# EasyEDA Pro project gd32e230c8t6v1.eprj

# Schematic GD32E230C8T6
Create Date: 2023-10-20; Page Name: GD32E230C8T6; Project Name: gd32e230c8t6v1; Schematic Name: GD32E230C8T6; Update Date: 2023-11-30; Add into BOM: yes; Company: 嘉立创EDA; Convert to PCB: yes; Page Size: A4; Version: V1.0
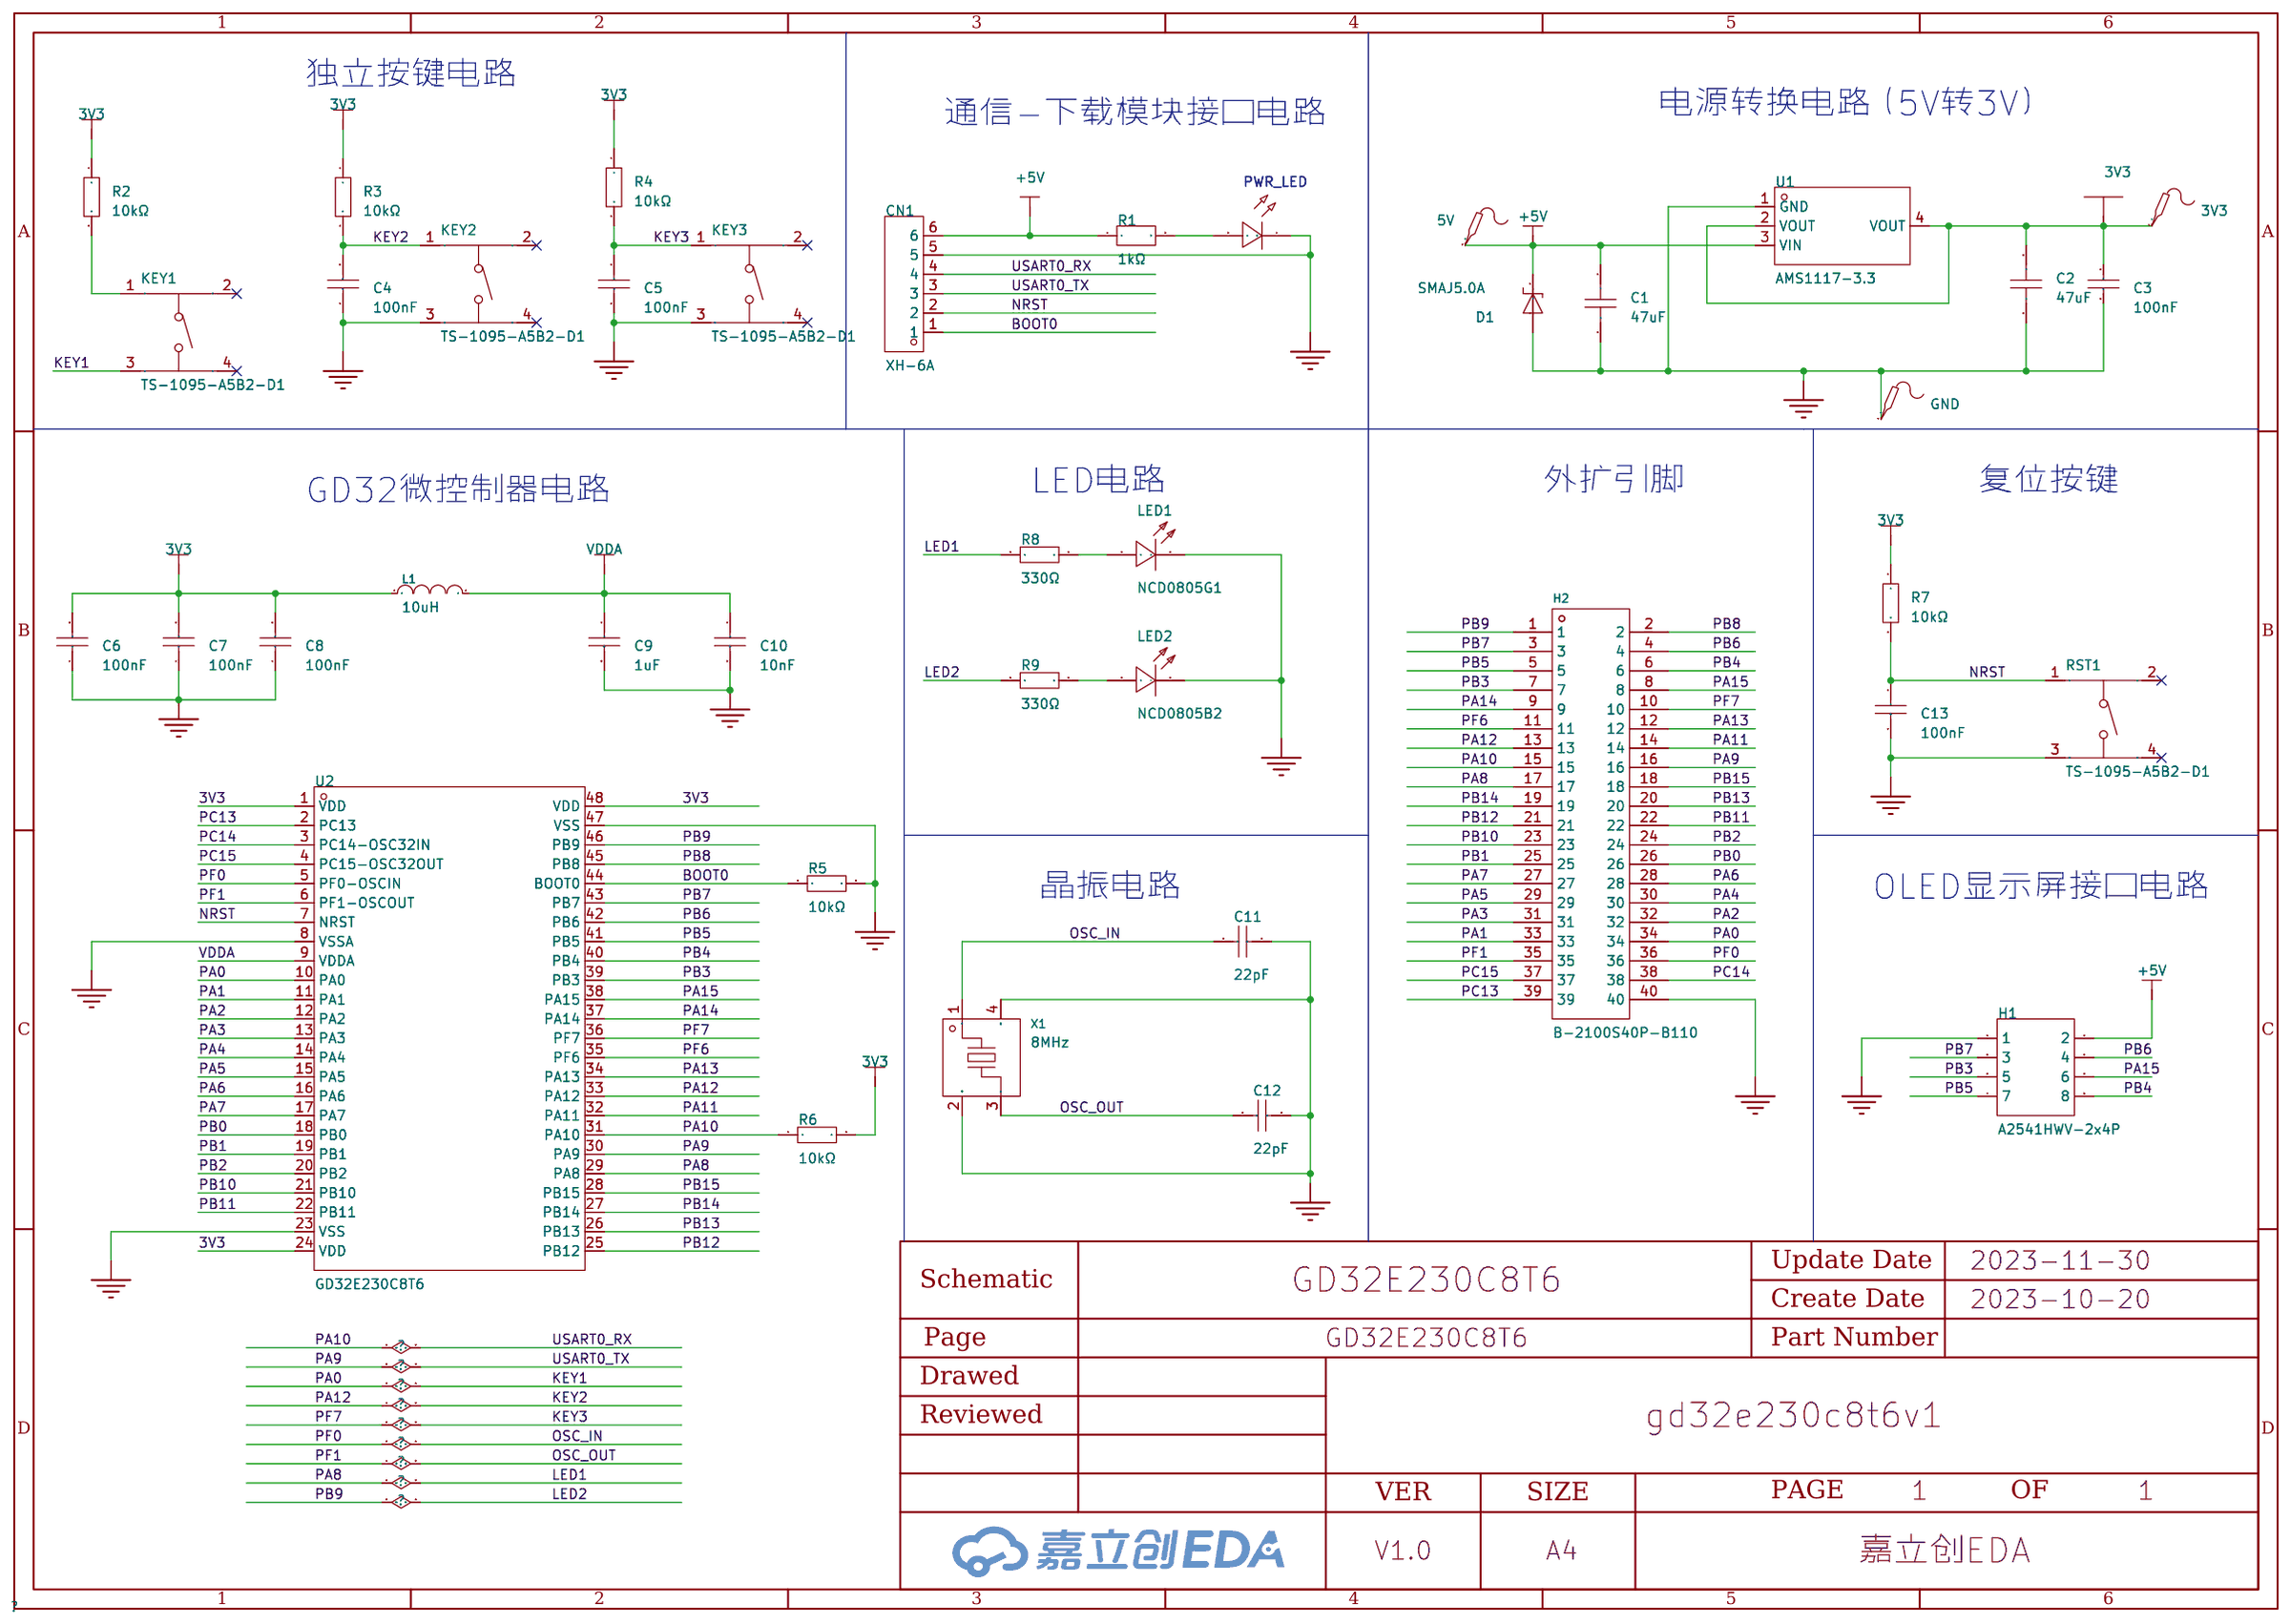
[diagram p0: schematic sheet]

## Parts
3V3  -  [Test-Point-0.5mm]
5V  -  [Test-Point-0.5mm]
C1  47uF  [C1206]
C2  47uF  [C1206]
C3  100nF  [C1206]
C4  100nF  [C0603]
C5  100nF  [C0603]
C6  100nF  [C0603]
C7  100nF  [C0603]
C8  100nF  [C0603]
C9  1uF  [C0603]
C10  10nF  [C0603]
C11  22pF  [C0603]
C12  22pF  [C0603]
C13  100nF  [C0603]
CN1  XH-6A  [CONN-TH_6P-P2.50_HCTL_XH-6A_C2908604]
D1  SMAJ5.0A  [SMA_L4.3-W2.6-LS5.2-FD]
GND  -  [Test-Point-0.5mm]
H1  A2541HWV-2x4P  [HDR-TH_8P-P2.54-V-F-R2-C4-S2.54-1]
H2  B-2100S40P-B110  [HDR-TH_40P-P2.54-V-M-R2-C20-S2.54]
KEY1  TS-1095-A5B2-D1  [SW-TH_4P-L6.0-W6.0-P4.50-LS6.5]
KEY2  TS-1095-A5B2-D1  [SW-TH_4P-L6.0-W6.0-P4.50-LS6.5]
KEY3  TS-1095-A5B2-D1  [SW-TH_4P-L6.0-W6.0-P4.50-LS6.5]
L1  10uH  [L0805]
LED1  NCD0805G1  [LED0805-R-RD]
LED2  NCD0805B2  [LED0805-R-RD]
PWR_LED  -  [LED_0805]
R1  1kΩ  [R0603]
R2  10kΩ  [R0603]
R3  10kΩ  [R0603]
R4  10kΩ  [R0603]
R5  10kΩ  [R0603]
R6  10kΩ  [R0603]
R7  10kΩ  [R0603]
R8  330Ω  [R0603]
R9  330Ω  [R0603]
RST1  TS-1095-A5B2-D1  [SW-TH_4P-L6.0-W6.0-P4.50-LS6.5]
U1  AMS1117-3.3  [SOT-223_L6.5-W3.5-P2.30-LS7.0-BR]
U2  GD32E230C8T6  [LQFP-48_L7.0-W7.0-P0.50-LS9.0-BL]
X1  8MHz  [OSC-SMD_4P-L3.2-W2.5-BL]

## Library data of the parts
3V3 5V GND = Test-Point: Test Point 测试点
C1 C2 = JMK325B7476KMHPR: 容值:47uF;精度:±10%;额定电压:6.3V;材质(温度系数):X7R;; LCSC Part Name: 47uF ±10% 6.3V; Supplier Part: C386026; Manufacturer: TAIYO YUDEN(太诱); Supplier Footprint: 1210; JLCPCB Part Class: Extended Part; Datasheet: https://atta.szlcsc.com/upload/public/pdf/source/20190827/C386026_5009711090E4AA535975339AD2C25863.pdf; Supplier: LCSC; Tolerance: ±10%; Voltage Rated: 6.3V; Temperature Coefficient: X7R
C3 = FN31X104K500PXG: 容值:100nF;精度:±10%;额定电压:50V;温度系数:X7R;; LCSC Part Name: 100nF ±10% 50V; Supplier Part: C464972; Manufacturer: PSA(信昌电陶); Supplier Footprint: 1206; JLCPCB Part Class: Extended Part; Datasheet: https://atta.szlcsc.com/upload/public/pdf/source/20191129/C464972_F56C30176D6B20CF6A8E48930D821D51.pdf; Supplier: LCSC; Tolerance: ±10%; Voltage Rated: 50V; Temperature Coefficient: X7R
C4-C8 C13 = 0603B104K500NT: 容值:100nF;精度:±10%;额定电压:50V;材质(温度系数):X7R;; LCSC Part Name: 100nF ±10% 50V; Supplier Part: C30926; Manufacturer: FH(风华); Supplier Footprint: 0603; JLCPCB Part Class: 扩展库; Datasheet: https://atta.szlcsc.com/upload/public/pdf/source/20170923/C30926_1506149436298988724.pdf; Supplier: LCSC; Tolerance: ±10%; Voltage Rated: 50V; Temperature Coefficient: X7R
C9 = CL10A105KB8NNNC: 容值:1uF;精度:±10%;额定电压:50V;材质(温度系数):X5R;; LCSC Part Name: 1uF ±10% 50V; Supplier Part: C15849; Manufacturer: SAMSUNG(三星); Supplier Footprint: 0603; JLCPCB Part Class: Basic Part; Datasheet: https://atta.szlcsc.com/upload/public/pdf/source/20160103/1457707679084.pdf; Supplier: LCSC; Tolerance: ±10%; Voltage Rated: 50V; Temperature Coefficient: X5R
C10 = CC0603KRX7R9BB103: 容值:10nF;精度:±10%;额定电压:50V;材质(温度系数):X7R;; LCSC Part Name: 10nF ±10% 50V; Supplier Part: C100042; Manufacturer: YAGEO(国巨); Supplier Footprint: 0603; JLCPCB Part Class: Extended Part; Datasheet: https://atta.szlcsc.com/upload/public/pdf/source/20180326/C100042_E8B0111D51DE3671A0A4A59FBCEFE81C.pdf; Supplier: LCSC; Tolerance: ±10%; Voltage Rated: 50V; Temperature Coefficient: X7R
C11 C12 = CL10C220JB8NNNC: 容值:22pF;精度:±5%;额定电压:50V;材质(温度系数):C0G;; LCSC Part Name: 22pF ±5% 50V; Supplier Part: C1653; Manufacturer: SAMSUNG(三星); Supplier Footprint: 0603; JLCPCB Part Class: 基础库; Datasheet: https://atta.szlcsc.com/upload/public/pdf/source/20160218/1457707763339.pdf; Supplier: LCSC; Tolerance: ±5%; Voltage Rated: 50V; Temperature Coefficient: C0G
CN1 = XH-6A: 参考系列:XH;间距:2.5mm;插针结构:1x6P;排数:1;每排PIN数:6;行距:-;公母:公型插针;安装方式:直插;额定电流:3A;工作温度范围:-25℃~+85℃;; LCSC Part Name: XH 2.5mm 1x6P 直插; Supplier Part: C2908604; Manufacturer: HCTL(华灿天禄); Supplier Footprint: 插件,P=2.5mm; JLCPCB Part Class: Extended Part; Datasheet: https://atta.szlcsc.com/upload/public/pdf/source/20211021/653319DEFF6FA72D109D92786067BD8A.pdf; Supplier: LCSC; Reference Series: XH; Pitch: 2.5mm; Pins Structure: 1x6P; Number of Rows: 1; Number of PINs Per Row: 6; Gender: 公型插针; Mounting Style: 直插; Current Rating (Max): 3A; Operating Temperature Range: -25℃~+85℃
D1 = SMAJ5.0A: 极性:单向;反向截止电压(Vrwm):5V;击穿电压(最小值):6.4V;击穿电压(最大值):7V;反向漏电流(Ir):800μA;峰值脉冲电流(Ipp)@10/1000μs:43.5A;最大钳位电压:9.2V;峰值脉冲功率(Ppp)@10/1000μs:400W;; LCSC Part Name: 单向 5V 400W; Supplier Part: C473803; Manufacturer: Slkor(萨科微); Supplier Footprint: SMA; JLCPCB Part Class: Extended Part; Datasheet: https://atta.szlcsc.com/upload/public/pdf/source/20191224/C473803_5CBD384FC89E392B1C1B87C7884E179E.pdf; Supplier: LCSC; Polarity: 单向; Reverse Stand-Off Voltage (Vrwm): 5V; Breakdown Voltage (Min): 6.4V; Breakdown Voltage (Max): 7V; Reverse Leakage Current (Ir): 800μA; Peak Pulse Current (Ipp)@10/1000μs: 43.5A; Maximum Clamping Voltage: 9.2V; Peak Pulse Power Dissipation (Ppp)@10/1000μs: 400W
H1 = A2541HWV-2x4P: 插孔结构:2x4P;间距:2.54mm;总孔位数:8P;安装类型:直插;排数:双排;行距:2.54mm;塑高:-;触头材质:黄铜;触头镀层:金;; LCSC Part Name: 间距:2.54mm 2x4P 直插; Supplier Part: C239344; Manufacturer: CJT(长江连接器); Supplier Footprint: 插件,P=2.54mm; JLCPCB Part Class: 扩展库; Datasheet: https://atta.szlcsc.com/upload/public/pdf/source/20180724/C239359_48B1BC0CA1B4E4396A63955AAFD15564.pdf; Supplier: LCSC; Holes Structure: 2x4P; Pitch: 2.54mm; Number of Holes: 8P; Mounting Type: 直插; Number of Rows: 双排; Row Spacing: 2.54mm; Contact Material: 黄铜; Contact Plating: 金
H2 = B-2100S40P-B110: 排数:双排;总PIN位数:40;间距:2.54mm;插针结构:2x20P;行距:2.54mm;安装类型:直插;圆针/方针:-;额定电流:-;额定电压:-;配合针长度:6mm;塑高:2.54mm;端接针长度:3mm;触头材质:黄铜;触头镀层:-;工作温度范围:-40℃~+105℃;颜色:黑色;; LCSC Part Name: 2.54mm 2x20P 直插; Supplier Part: C124383; Manufacturer: Ckmtw(灿科盟); Supplier Footprint: 直插,P=2.54mm; JLCPCB Part Class: 扩展库; Supplier: LCSC; Number of Rows: 双排; Number of Pins: 40; Pitch: 2.54mm; Pin Structure: 2x20P; Row Spacing: 2.54mm; Mounting Type: 直插; Length of Mating Pin: 6mm; Insulation Height: 2.54mm; Length of End Connection Pin: 3mm; Contact Material: 黄铜; Operating Temperature Range: -40℃~+105℃; Color: 黑色
KEY1-KEY3 RST1 = TS-1095-A5B2-D1: 电路结构:单刀单掷;安装方式:直插;作用力:180gf@±30gf;机械寿命:-;带支架:否;; LCSC Part Name: 6*6*6mm 直插 轻触开关; Supplier Part: C782808; Manufacturer: Yuandi(元迪); Supplier Footprint: 插件; JLCPCB Part Class: 扩展库; Datasheet: https://atta.szlcsc.com/upload/public/pdf/source/20200908/C782804_D14F61DCCBE05C7EE913124CF28857B3.pdf; Supplier: LCSC; Circuit: 单刀单掷; Mounting Style: 直插; Actuator Style: 圆形按钮; Actuator/Cap Color: 黑色; Operating Force: 180gf@±30gf; Pin Style: PC引脚; Switch Length: 6mm; Switch Width: 6mm; Switch Height: 6mm; Strike Gundam: 否
L1 = MCL2012H100MT: 电感值:10uH;精度:±20%;额定电流:100mA;饱和电流(Isat):-;直流电阻(DCR):650mΩ;; LCSC Part Name: 10uH ±20%; Supplier Part: C95978; Manufacturer: Sunlord(顺络); Supplier Footprint: 0805; JLCPCB Part Class: 扩展库; Datasheet: https://atta.szlcsc.com/upload/public/pdf/source/20210916/E7612CB06B128615267F10BD851E53EF.pdf; Supplier: LCSC; Tolerance: ±20%; Rated Current: 100mA; DC Resistance (DCR): 650mΩ; Frequency - Self Resonant: 20MHz
LED1 = NCD0805G1: 发光颜色:翠绿色;功率:72mW;透镜颜色:无色透明;主波长:525nm~537.5nm;发光强度:180mcd~400mcd;发光角度:130°;工作温度:-30℃~+85℃;; LCSC Part Name: 翠绿 0805翠绿  正贴; Supplier Part: C84260; Manufacturer: 国星光电; Supplier Footprint: 0805; JLCPCB Part Class: 扩展库; Datasheet: https://atta.szlcsc.com/upload/public/pdf/source/20200820/C84260_AFC7BF57C6FBA034D182BB8D10A67EFE.pdf; Supplier: LCSC; Emitted Color: 翠绿色; Forward Voltage (VF): 2.5V~3.6V; Forward Current: 5mA; Power Dissipation: 72mW; Lens Color: 无色透明; Dominant Wavelength: 525nm~537.5nm; Luminous Intensity: 180mcd~400mcd; Viewing Angle: 130°; Operating Temperature: -30℃~+85℃
LED2 = NCD0805B2: 发光颜色:蓝色;功率:72mW;透镜颜色:无色透明;主波长:468nm~478nm;发光强度:20mcd~55mcd;发光角度:130°;工作温度:-30℃~+85℃;; LCSC Part Name: 蓝灯 0805蓝灯   正贴; Supplier Part: C84259; Manufacturer: 国星光电; Supplier Footprint: 0805; JLCPCB Part Class: 扩展库; Datasheet: https://atta.szlcsc.com/upload/public/pdf/source/20200820/C84259_E5AC6865415989C4C2C2831134BA3A23.pdf; Supplier: LCSC; Emitted Color: 蓝色; Forward Voltage (VF): 2.5V~3.6V; Forward Current: 2mA; Power Dissipation: 72mW; Lens Color: 无色透明; Dominant Wavelength: 468nm~478nm; Luminous Intensity: 20mcd~55mcd; Viewing Angle: 130°; Operating Temperature: -30℃~+85℃
PWR_LED = LED_0805-B: Supplier Footprint: 0805
R1 = CRCW02011K00JNED: 电阻类型:厚膜电阻;阻值:1kΩ;精度:±5%;功率:50mW;温度系数:±200ppm/℃;; LCSC Part Name: 厚膜电阻 1kΩ ±5% 50mW; Supplier Part: C2073617; Manufacturer: VISHAY(威世); Supplier Footprint: 0201; JLCPCB Part Class: Extended Part; Datasheet: https://atta.szlcsc.com/upload/public/pdf/source/20210426/0D611F86AB3126A358A21AB7F04A2FCC.pdf; Supplier: LCSC; Type: 厚膜电阻; Tolerance: ±5%; Power(Watts): 50mW; Temperature Coefficient: ±200ppm/℃; Overload Voltage (Max): 30V; Operating Temperature Range: -55℃~+155℃
R2-R7 = 0603WAF1002T5E: 电阻类型:厚膜电阻;阻值:10kΩ;精度:±1%;功率:100mW;; LCSC Part Name: 厚膜电阻 10kΩ ±1% 100mW; Supplier Part: C25804; Manufacturer: UNI-ROYAL(厚声); Supplier Footprint: 0603; JLCPCB Part Class: 基础库; Datasheet: https://atta.szlcsc.com/upload/public/pdf/source/20200306/C422600_1E6D84923E4A46A82E41ADD87F860B5C.pdf; Supplier: LCSC; Type: 厚膜电阻; Tolerance: ±1%; Power(Watts): 100mW; Temperature Coefficient: ±100ppm/℃; Overload Voltage (Max): 75V; Operating Temperature Range: -55℃~+155℃
R8 R9 = 0603WAF3300T5E: 阻值:330Ω;精度:±1%;功率:100mW;温度系数:±100ppm/℃;电阻类型:厚膜电阻;; LCSC Part Name: 330Ω ±1% 100mW 厚膜电阻; Supplier Part: C23138; Manufacturer: UNI-ROYAL(厚声); Supplier Footprint: 0603; JLCPCB Part Class: 基础库; Datasheet: https://atta.szlcsc.com/upload/public/pdf/source/20200306/C422600_1E6D84923E4A46A82E41ADD87F860B5C.pdf; Supplier: LCSC; Tolerance: ±1%; Power(Watts): 100mW; Overload Voltage (Max): 75V; Temperature Coefficient: ±100ppm/℃; Type: 厚膜电阻; Operating Temperature Range: -55℃~+155℃
U1 = AMS1117-5.0_C6187: 输出类型:固定;输出极性:正;输出通道数:1;最大输入电压:15V;输出电压:5V;压差:1.3V@(1A);输出电流:1A;电源纹波抑制比(PRSS):68dB@(120Hz);; LCSC Part Name: Vin=15V Vout=5V 1A 68dB@(120Hz); Supplier Part: C6187; Manufacturer: 美国AMS; Supplier Footprint: SOT-223; JLCPCB Part Class: Basic Part; Datasheet: https://atta.szlcsc.com/upload/public/pdf/source/20120416/1457706470701.pdf; Supplier: LCSC; Output Type: 固定; Output Polarity: 正; Number of Outputs: 1; Maximum Input Voltage: 15V; Output Voltage: 5V; Dropout Voltage: 1.3V@(1A); Output Current: 1A; Power Supply Rejection Ratio (PRSS): 68dB@(120Hz)
U2 = GD32E230C8T6: CPU内核:ARM-M系列;CPU最大主频:72MHz;程序存储容量:64KB;程序存储器类型:FLASH;RAM总容量:8KB;GPIO端口数量:39;; LCSC Part Name: ARM-M系列 72MHz; Supplier Part: C380535; Manufacturer: GigaDevice(兆易创新); Supplier Footprint: LQFP-48(7x7); JLCPCB Part Class: 扩展库; Datasheet: https://atta.szlcsc.com/upload/public/pdf/source/20191028/C380535_2A3608A1B122F87D1E8A29B0B3E313D6.pdf; Supplier: LCSC; CPU Core: ARM-M系列; CPU Maximum Speed: 72MHz; Operating Voltage Range: 1.8V~3.6V; Program Storage Size: 64KB; Program Memory Type: FLASH; RAM Size: 8KB; GPIO Ports Number: 39; ADC (Bit): 12bit; PWM (Bit): 16bit; 16Bit Timer: 6; UART/USART: 2; I2C: 2; SPI: 2; Internal Comparator: 有; Peripheral/Function: 片载温度传感器；DMA；看门狗；LIN总线协议；PWM；IrDA；RTC实时时钟; Watchdog: 有; Real-Time Clock: 有; Infrared Data Association: 有; Direct Memory Access: 有; Internal Oscillator: 有; Operating Temperature Range: -40℃~+85℃
X1 = X32258MOB4SI: 频率:8MHz;频率公差:±10ppm;负载电容:12pF;; LCSC Part Name: 8MHz ±10ppm 12pF YSX321SL; Supplier Part: C2682775; Manufacturer: YXC(扬兴晶振); Supplier Footprint: SMD3225-4P; JLCPCB Part Class: 扩展库; Datasheet: https://atta.szlcsc.com/upload/public/pdf/source/20210106/C2682774_0CD4FDA5D9DA3FBEEC23BD607A48E4B0.pdf; Supplier: LCSC; Crystal Type: 贴片无源晶振; Frequency Tolerance: ±10ppm; Frequency Stability: ±30ppm; Load Capacitance: 12pF; Equivalent Series Resistance (ESR): 150Ω; Operating Temperature: -40℃~+85℃

## Nets
3V3: 3V3.1 C2.1 C3.1 C6.2 C7.2 C8.2 L1.1 R2.1 R3.1 R4.1 R6.2 R7.1 U1.2(VOUT) U1.4(VOUT) U2.1(VDD) U2.24(VDD) U2.48(VDD)
+5V: 5V.1 C1.1 CN1.6 D1.2(K) H1.2 R1.1 U1.3(VIN)
GND: C1.2 C2.2 C3.2 C4.1 C5.2 C6.1 C7.1 C8.1 C9.2 C10.2 C11.2 C12.2 C13.2 CN1.5 D1.1(A) GND.1 H1.1 H2.40 KEY2.3 KEY3.3 LED1.2(K) LED2.2(-) PWR_LED.1(C) R5.2 RST1.3 U1.1(GND) U2.8(VSSA) U2.23(VSS) U2.47(VSS) X1.2(GND) X1.4(GND)
VDDA: C9.1 C10.1 L1.2 U2.9(VDDA)
BOOT0: CN1.1 R5.1 U2.44(BOOT0)
KEY1: H2.34 KEY1.3 U2.10(PA0)
KEY2: C4.2 H2.13 KEY2.1 R3.2 U2.33(PA12)
KEY3: C5.1 H2.10 KEY3.1 R4.2 U2.36(PF7)
LED1: H2.17 R8.1 U2.29(PA8)
LED2: H2.1 R9.1 U2.46(PB9)
NRST: C13.1 CN1.2 R7.2 RST1.1 U2.7(NRST)
OSC_IN: C11.1 H2.36 U2.5(PF0-OSCIN) X1.1
OSC_OUT: C12.1 H2.35 U2.6(PF1-OSCOUT) X1.3
PA1: H2.33 U2.11(PA1)
PA2: H2.32 U2.12(PA2)
PA3: H2.31 U2.13(PA3)
PA4: H2.30 U2.14(PA4)
PA5: H2.29 U2.15(PA5)
PA6: H2.28 U2.16(PA6)
PA7: H2.27 U2.17(PA7)
PA9: CN1.3 H2.16 U2.30(PA9)
PA10: CN1.4 H2.15 R6.1 U2.31(PA10)
PA11: H2.14 U2.32(PA11)
PA13: H2.12 U2.34(PA13)
PA14: H2.9 U2.37(PA14)
PA15: H1.6 H2.8 U2.38(PA15)
PB0: H2.26 U2.18(PB0)
PB1: H2.25 U2.19(PB1)
PB2: H2.24 U2.20(PB2)
PB3: H1.5 H2.7 U2.39(PB3)
PB4: H1.8 H2.6 U2.40(PB4)
PB5: H1.7 H2.5 U2.41(PB5)
PB6: H1.4 H2.4 U2.42(PB6)
PB7: H1.3 H2.3 U2.43(PB7)
PB8: H2.2 U2.45(PB8)
PB10: H2.23 U2.21(PB10)
PB11: H2.22 U2.22(PB11)
PB12: H2.21 U2.25(PB12)
PB13: H2.20 U2.26(PB13)
PB14: H2.19 U2.27(PB14)
PB15: H2.18 U2.28(PB15)
PC13: H2.39 U2.2(PC13)
PC14: H2.38 U2.3(PC14-OSC32IN)
PC15: H2.37 U2.4(PC15-OSC32OUT)
PF6: H2.11 U2.35(PF6)
$1N1351: PWR_LED.2(A) R1.2
$1N1886: KEY1.1 R2.2
$1N6758: LED1.1(A) R8.2
$1N6761: LED2.1(+) R9.2

Not connected (* = marked no-connect by the designer): KEY1 2* 4*; KEY2 2* 4*; KEY3 2* 4*; RST1 2* 4*

## Notes on the sheet
- 独立按键电路
- 通信-下载模块接口电路
- 电源转换电路（5V转3V）
- LED电路
- 外扩引脚
- 复位按键
- GD32微控制器电路
- 晶振电路
- OLED显示屏接口电路

# Board GD32E230C8T6
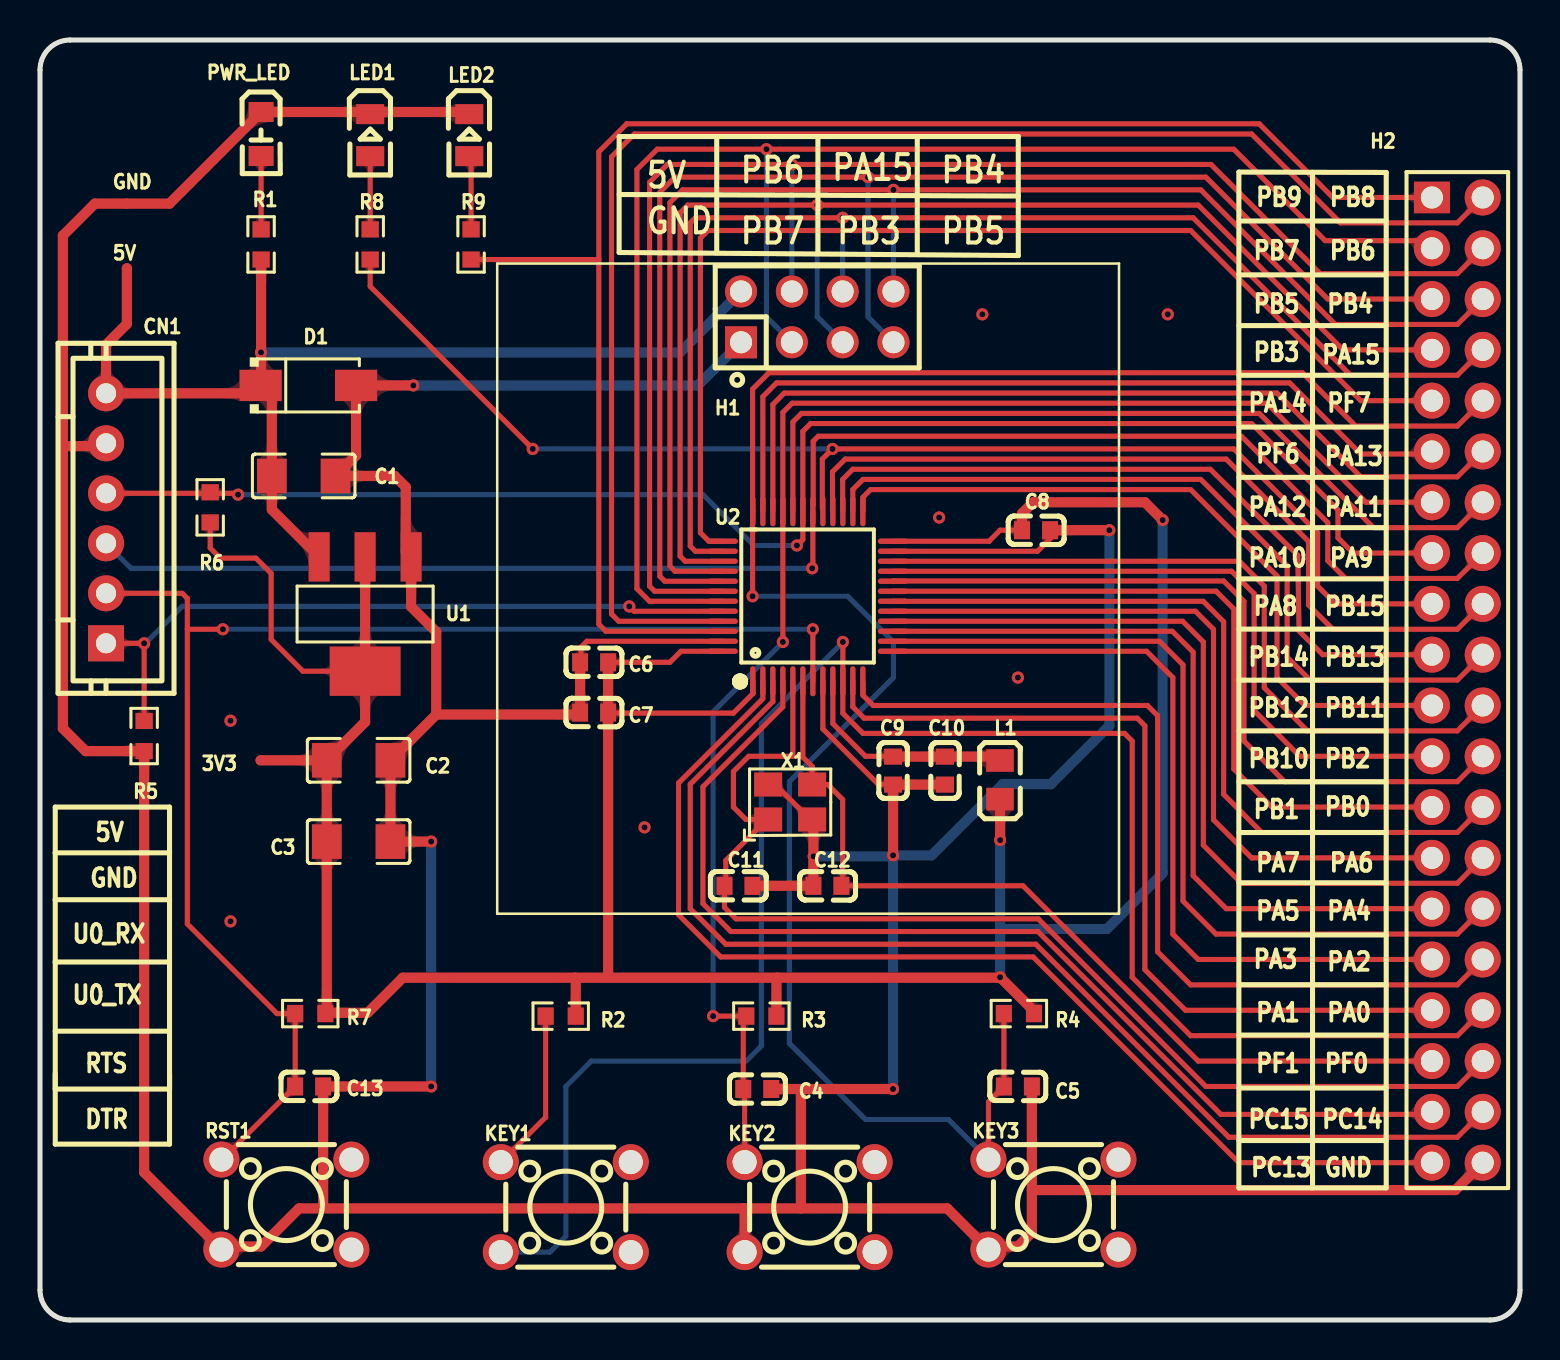
[diagram p1: board, top side]
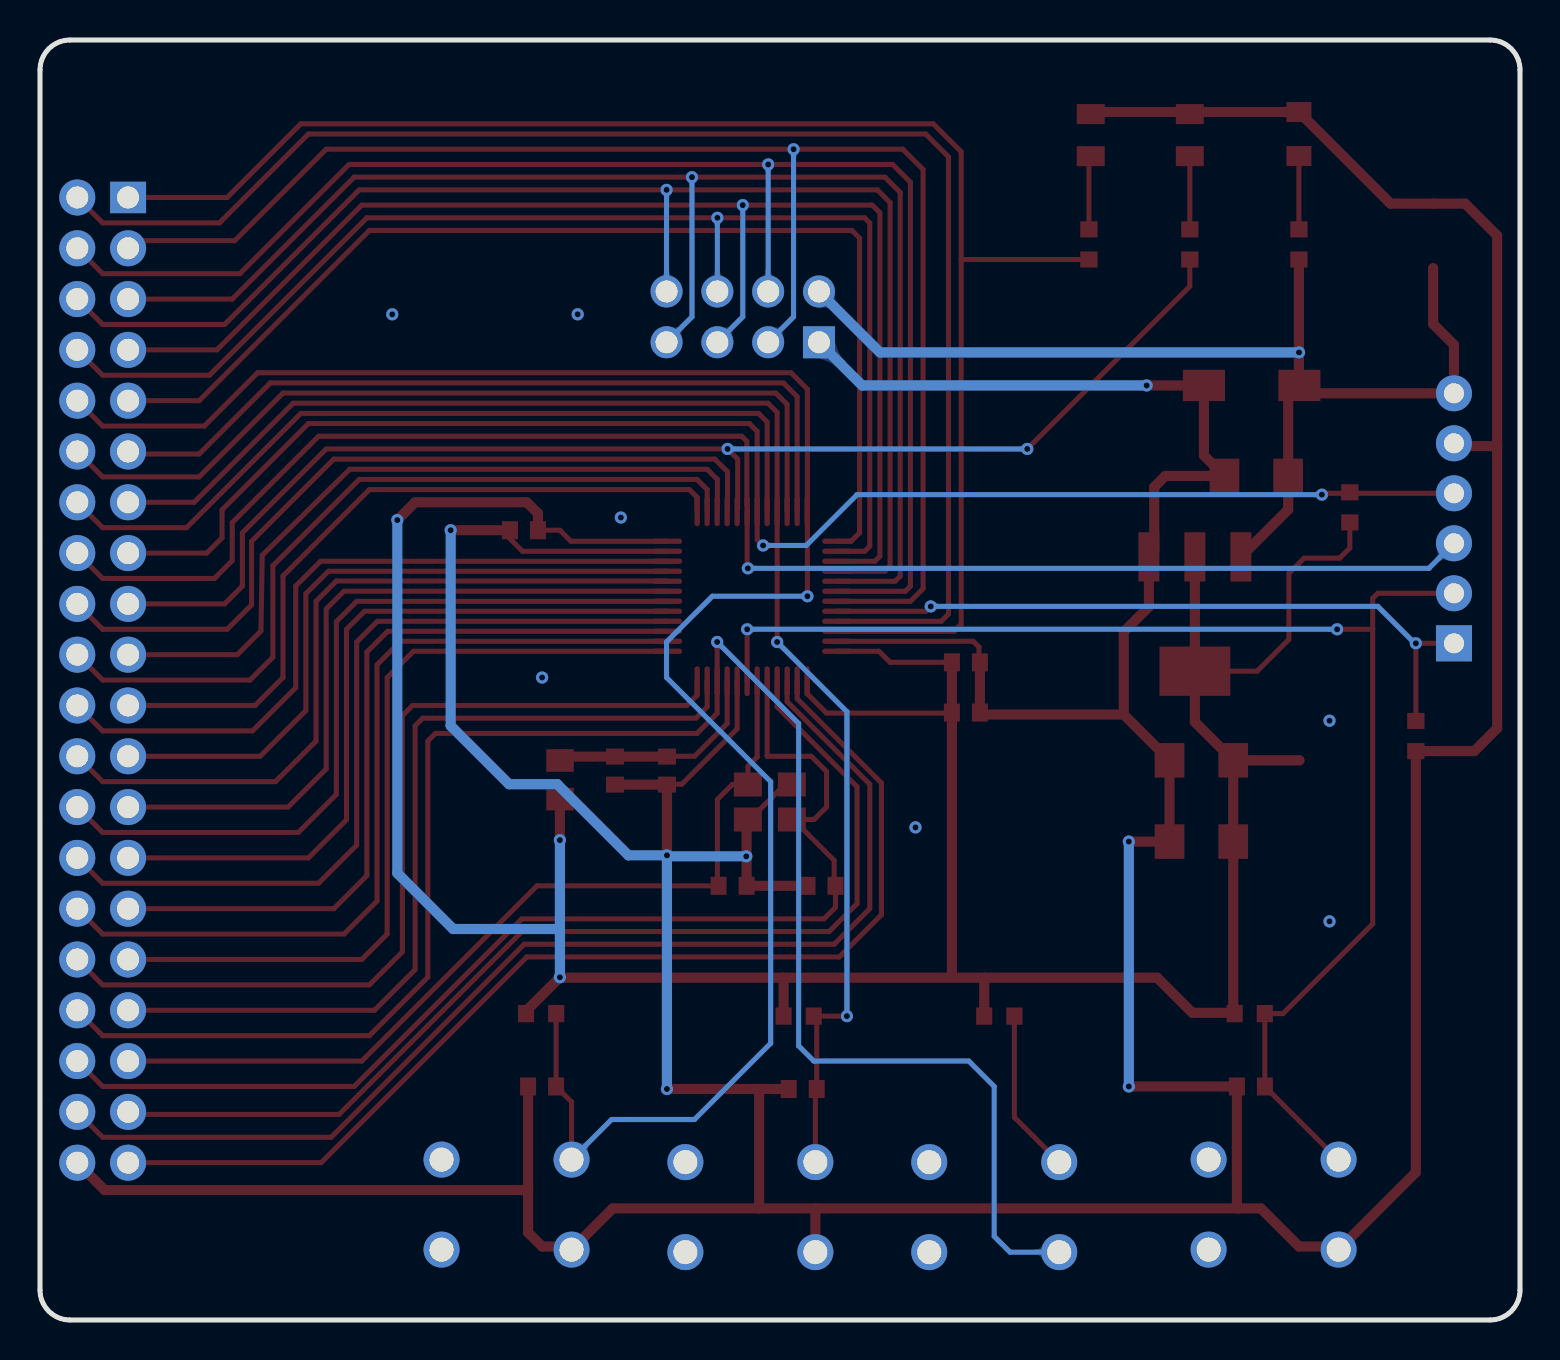
[diagram p2: board, bottom side, seen from below]

Outline 74 x 64 mm; copper layers: Top Layer, Bottom Layer. Coordinates in mm from the lower left corner of the outline.
Outline path: 0,62.5 0,1.5 arc(0.44,0.44) 1.5,0 72.5,0 arc(73.56,0.44) 74,1.5 74,62.5 arc(73.56,63.56) 72.5,64 1.5,64 arc(0.44,63.56) 0,62.5
Stack: Top Layer 0.035mm / Dielectric1 1.51mm FR4 er 4.5 / Bottom Layer 0.035mm

## Design rules (mm)
template: 自定义配置
spacing copperThickness1oz: track to track 0.102, other pairs 0.152 to 0.3
spacing copperThickness2oz: track to track 0.203, other pairs 0.152 to 0.3
spacing safeClearance (default): track to track 0.203, other pairs 0.203 to 0.203
track width copperThickness1oz: min 0.127, default 0.254, max 2.54
track width copperThickness2oz: min 0.203, default 0.254, max 2.54
track width trackWidth (default): min 0.254, default 0.254, max 0.762
track width VCC and GND: min 0.127, default 0.762, max 0.762
differential pair differentialPair (default): width min 0.127, default 0.254, max 2.54; gap min 0.152, default 0.152
via viaSize (default): diameter min 0.5, default 0.61, max 10; hole min 0.3, default 0.305, max 5.999
net GND uses VCC and GND
net +5V uses VCC and GND
net 3V3 uses VCC and GND

## Placement (name value [footprint] x y rotation side)
3V3  -  [Test-Point-0.5mm]  11.03 27.98 0 top
5V  -  [Test-Point-0.5mm]  4.34 52.59 0 top
C1  47uF  [C1206]  13.18 42.2 0 top
C2  47uF  [C1206]  15.93 27.98 0 top
C3  100nF  [C1206]  15.93 23.92 0 top
C4  100nF  [C0603]  35.86 11.55 180 top
C5  100nF  [C0603]  48.9 11.68 0 top
C6  100nF  [C0603]  27.71 32.89 0 top
C7  100nF  [C0603]  27.71 30.37 0 top
C8  100nF  [C0603]  49.8 39.49 180 top
C9  1uF  [C0603]  42.65 27.47 270 top
C10  10nF  [C0603]  45.25 27.47 270 top
C11  22pF  [C0603]  34.93 21.71 0 top
C12  22pF  [C0603]  39.37 21.71 180 top
C13  100nF  [C0603]  13.46 11.68 0 top
CN1  XH-6A  [CONN-TH_6P-P2.50_HCTL_XH-6A_C2908604]  3.3 40.08 90 top
D1  SMAJ5.0A  [SMA_L4.3-W2.6-LS5.2-FD]  13.42 46.73 180 top
GND  -  [Test-Point-0.5mm]  4.34 55.82 0 top
H1  A2541HWV-2x4P  [HDR-TH_8P-P2.54-V-F-R2-C4-S2.54-1]  38.86 50.16 0 top
H2  B-2100S40P-B110  [HDR-TH_40P-P2.54-V-M-R2-C20-S2.54]  70.87 32 270 top
KEY1  TS-1095-A5B2-D1  [SW-TH_4P-L6.0-W6.0-P4.50-LS6.5]  26.29 5.64 0 top
KEY2  TS-1095-A5B2-D1  [SW-TH_4P-L6.0-W6.0-P4.50-LS6.5]  38.48 5.64 0 top
KEY3  TS-1095-A5B2-D1  [SW-TH_4P-L6.0-W6.0-P4.50-LS6.5]  50.67 5.77 0 top
L1  10uH  [L0805]  48 27.01 90 top
LED1  NCD0805G1  [LED0805-R-RD]  16.51 59.24 270 top
LED2  NCD0805B2  [LED0805-R-RD]  21.46 59.24 270 top
PWR_LED  -  [LED_0805]  11.05 59.25 270 top
R1  1kΩ  [R0603]  11.05 53.78 90 top
R2  10kΩ  [R0603]  26.03 15.19 180 top
R3  10kΩ  [R0603]  36.07 15.19 180 top
R4  10kΩ  [R0603]  48.94 15.32 180 top
R5  10kΩ  [R0603]  5.21 29.2 270 top
R6  10kΩ  [R0603]  8.51 40.63 270 top
R7  10kΩ  [R0603]  13.51 15.32 180 top
R8  330Ω  [R0603]  16.51 53.78 90 top
R9  330Ω  [R0603]  21.55 53.78 90 top
RST1  TS-1095-A5B2-D1  [SW-TH_4P-L6.0-W6.0-P4.50-LS6.5]  12.32 5.77 0 top
U1  AMS1117-3.3  [SOT-223_L6.5-W3.5-P2.30-LS7.0-BR]  16.26 35.3 90 top
U2  GD32E230C8T6  [LQFP-48_L7.0-W7.0-P0.50-LS9.0-BL]  38.39 36.19 0 top
X1  8MHz  [OSC-SMD_4P-L3.2-W2.5-BL]  37.51 25.9 0 top

## Footprints (pads in the part's own frame, mm; a bottom-side part is the same pattern mirrored in y, then rotated)
C0603
  rect 0.8x0.9 smd: 1(-0.7,0) 2(0.7,0)
C1206
  rect 1.485x1.728 smd: 1(-1.593,0) 2(1.593,0)
CONN-TH_6P-P2.50_HCTL_XH-6A_C2908604
  rect 1.8x1.8 hole 1: 1(-6.25,0.001)
  round 1.8 hole 1: 2(-3.749,0.001) 3(-1.25,0.001) 4(1.25,0) 5(3.75,-0.001) 6(6.25,-0.001)
HDR-TH_8P-P2.54-V-F-R2-C4-S2.54-1
  rect 1.6x1.6 hole 1.1: 1(-3.81,-1.27)
  round 1.6 hole 1.1: 2(-3.81,1.27) 3(-1.27,-1.27) 4(-1.27,1.27) 5(1.27,-1.27) 6(1.27,1.27) 7(3.81,-1.27) 8(3.81,1.27)
HDR-TH_40P-P2.54-V-M-R2-C20-S2.54
  rect 1.575x1.8 hole 1.1: 1(-24.13,-1.27)
  round 1.8 hole 1.1: 2(-24.13,1.27) 3(-21.59,-1.27) 4(-21.59,1.27) 5(-19.05,-1.27) 6(-19.05,1.27) 7(-16.51,-1.27) 8(-16.51,1.27) 9(-13.97,-1.27) 10(-13.97,1.27) 11(-11.43,-1.27) 12(-11.43,1.27) 13(-8.89,-1.27) 14(-8.89,1.27) 15(-6.35,-1.27) 16(-6.35,1.27) 17(-3.81,-1.27) 18(-3.81,1.27) 19(-1.27,-1.27) 20(-1.27,1.27) 21(1.27,-1.27) 22(1.27,1.27) 23(3.81,-1.27) 24(3.81,1.27) 25(6.35,-1.27) 26(6.35,1.27) 27(8.89,-1.27) 28(8.89,1.27) 29(11.43,-1.27) 30(11.43,1.27) 31(13.97,-1.27) 32(13.97,1.27) 33(16.51,-1.27) 34(16.51,1.27) 35(19.05,-1.27) 36(19.05,1.27) 37(21.59,-1.27) 38(21.59,1.27) 39(24.13,-1.27) 40(24.13,1.27)
L0805
  rect 1.133x1.377 smd: 1(-0.966,0) 2(0.966,0)
LED0805-R-RD
  rect 1x1.399 smd: 1(1.05,0) 2(-1.05,0)
LED_0805
  rect 1x1.25 smd: 1(-1.15,0.005) 2(1.05,0.005)
LQFP-48_L7.0-W7.0-P0.50-LS9.0-BL
  oval 0.27x1.5 smd: 1(-2.75,-4.25) 2(-2.25,-4.25) 3(-1.75,-4.25) 4(-1.25,-4.25) 5(-0.75,-4.25) 6(-0.25,-4.25) 7(0.25,-4.25) 8(0.75,-4.25) 9(1.25,-4.25) 10(1.75,-4.25) 11(2.25,-4.25) 12(2.75,-4.25) 25(2.75,4.25) 26(2.25,4.25) 27(1.75,4.25) 28(1.25,4.25) 29(0.75,4.25) 30(0.25,4.25) 31(-0.25,4.25) 32(-0.75,4.25) 33(-1.25,4.25) 34(-1.75,4.25) 35(-2.25,4.25) 36(-2.75,4.25)
  oval 1.5x0.27 smd: 13(4.25,-2.75) 14(4.25,-2.25) 15(4.25,-1.75) 16(4.25,-1.25) 17(4.25,-0.75) 18(4.25,-0.25) 19(4.25,0.25) 20(4.25,0.75) 21(4.25,1.25) 22(4.25,1.75) 23(4.25,2.25) 24(4.25,2.75) 37(-4.25,2.75) 38(-4.25,2.25) 39(-4.25,1.75) 40(-4.25,1.25) 41(-4.25,0.75) 42(-4.25,0.25) 43(-4.25,-0.25) 44(-4.25,-0.75) 45(-4.25,-1.25) 46(-4.25,-1.75) 47(-4.25,-2.25) 48(-4.25,-2.75)
OSC-SMD_4P-L3.2-W2.5-BL
  rect 1.4x1.2 smd: 1(-1.1,-0.875) 2(1.1,-0.875) 3(1.1,0.875) 4(-1.1,0.875)
R0603
  rect 0.806x0.864 smd: 1(-0.753,0) 2(0.753,0)
SMA_L4.3-W2.6-LS5.2-FD
  rect 2.107x1.566 smd: 1(-2.386,0) 2(2.386,0)
SOT-223_L6.5-W3.5-P2.30-LS7.0-BR
  rect 2.465x1.05 smd: 1(2.857,-2.3) 2(2.857,0) 3(2.857,2.3)
  rect 2.465x3.54 smd: 4(-2.857,0)
SW-TH_4P-L6.0-W6.0-P4.50-LS6.5
  round 1.8 hole 1.2: 1(-3.25,2.25) 2(3.25,2.25) 3(-3.25,-2.25) 4(3.25,-2.25)
Test-Point-0.5mm
  round 0.5 smd: 1(0,0)

## Nets
As in the schematic.

Pads without a net: KEY1 2 4; KEY2 2 4; KEY3 2 4; RST1 2 4

## Via types
v1: diameter 0.61, hole 0.305, Top Layer to Bottom Layer, 37 vias

## Routing (per net, layer and track width the routed paths; a pad name or vN(x,y) marks a point on that pad's centre or on a via; arc(x,y) is an arc through that point)
3V3: length 162.3
  Top Layer w0.254: U2.24 47.45,38.94 48.01,39.49 C8.2 ; R6.2 8.51,38.6 9.02,38.09 10.8,38.09 11.56,37.33 11.56,34.03 13.14,32.44 U1.4 ; C6.2 31.5,32.89 32.05,33.44 U2.48 ; U2.1 35.64,31.32 34.67,30.34 28.43,30.34 C7.2
  Top Layer w0.508: 14.34,15.39 14.37,15.36 16.38,15.36 18.14,17.12 26.76,17.12 ; 14.34,15.39 R7.1 ; 14.34,15.39 C3.1 C2.1 ; R3.1 36.82,17.09 36.85,17.12 ; U1.2 U1.4 16.26,29.9 C2.1 ; 26.76,17.12 36.85,17.12 ; 26.76,17.12 26.79,17.09 R2.1 ; 36.85,17.12 47.98,17.12 v1(48.01,17.14) 49.66,15.49 49.66,15.32 R4.1 ; C2.1 3V3.1 ; 28.41,17.16 C7.2 C6.2 ; v1(56.13,40) 55.25,40.89 49.66,40.89 49.1,40.33 C8.2 ; v1(48.01,24) 48.01,26.04 L1.1
  Bottom Layer w0.508: 48.01,19.55 53.34,19.55 56.13,22.34 v1(56.13,40) ; 48.01,19.55 v1(48.01,24) ; 48.01,19.55 v1(48.01,17.14)
+5V: length 56
  Top Layer w0.508: CN1.6 3.43,46.33 ; 3.43,46.33 10.64,46.33 11.03,46.73 ; 3.43,46.33 3.3,46.46 3.3,48.76 4.34,49.8 5V.1 ; R1.1 11.05,46.75 11.03,46.73 ; 11.03,46.73 11.59,46.17 C1.1 11.59,40.52 U1.3
  Bottom Layer w0.508: 35.05,51.43 32,48.38 v1(11.05,48.38)
GND: length 332.6
  Top Layer w0.254: 16.4,60.4 LED1.2 ; U2.47 27.34,33.94 27.05,33.65 27.05,32.93 27,32.89 ; U2.23 49.88,38.44 50.67,39.23 ; X1.4 36.76,26.78 38.51,25.03 38.61,25.03 ; C9.2 42.63,26.79 41.91,26.79 39.14,29.56 U2.8
  Top Layer w0.508: 35.19,5.58 14.1,5.58 ; 35.19,5.58 35.23,5.54 KEY2.3 ; 35.19,5.58 38.04,5.58 ; 14.1,5.58 12.95,5.58 11.05,3.68 9.22,3.68 RST1.3 5.21,7.38 R5.2 2.28,28.44 1.14,29.58 1.14,43.69 ; 14.1,5.58 14.16,5.64 C13.2 v1(19.56,11.68) ; 38.04,11.55 v1(42.65,11.55) ; 38.04,11.55 C4.1 ; 38.04,11.55 38.04,5.58 ; 1.14,43.69 3.16,43.69 CN1.5 ; 1.14,43.69 1.14,54.22 2.74,55.82 GND.1 6.47,55.82 PWR_LED.1 21.36,60.4 LED2.2 ; v1(42.65,23.23) C9.2 C10.2 ; C8.1 v1(53.47,39.49) ; 19.81,30.27 19.81,34.41 18.56,35.67 U1.1 18.29,38.42 18.29,41.65 17.73,42.2 14.78,42.2 15.8,43.23 D1.1 v1(18.67,46.73) ; 19.81,30.27 C2.2 C3.2 v1(19.56,23.92) ; 19.81,30.27 26.91,30.27 27,30.37 27,32.89 ; 49.59,6.5 49.59,4.38 48.9,3.68 47.58,3.68 KEY3.3 45.36,5.58 38.04,5.58 ; 49.59,6.5 70.77,6.5 H2.40 ; 49.59,6.5 C5.2 ; C11.2 C12.2 38.67,24.96 38.61,25.03
  Bottom Layer w0.508: v1(42.65,11.55) v1(42.65,23.23) 44.58,23.23 48.13,26.79 50.55,26.79 53.47,29.71 v1(53.47,39.49) ; v1(38.69,23.18) 42.54,23.18 ; v1(18.67,46.73) 32.89,46.73 H1.1 ; v1(19.56,23.92) v1(19.56,11.68)
  vias: v1(9.53,29.96) v1(9.53,19.93) v1(30.23,24.63) v1(44.96,40.12) v1(47.12,50.28) v1(48.9,32.12) v1(56.39,50.28)
VDDA: length 11.2
  Top Layer w0.254: C9.1 42.64,28.19 41.28,28.19 39.64,29.82 U2.9
  Top Layer w0.508: L1.2 47.81,28.17 C10.1 C9.1
BOOT0: length 35.6
  Top Layer w0.254: R5.1 v1(5.21,33.83) CN1.1 ; U2.44 29.71,35.44 v1(29.46,35.68)
  Bottom Layer w0.254: v1(29.46,35.68) 29.47,35.68 29.47,35.68 7.11,35.68 5.2,33.77
KEY1: length 93.3
  Top Layer w0.254: v1(40.14,33.9) U2.10 40.14,30.33 41.15,29.33 54.23,29.33 54.61,28.95 54.61,17.14 57.53,14.22 70.87,14.22 H2.34
  Bottom Layer w0.254: v1(40.14,33.9) 36.07,29.83 36.07,13.71 35.31,12.95 27.56,12.95 26.29,11.68 26.29,4.18 25.5,3.39 KEY1.3
KEY2: length 75.4
  Top Layer w0.254: KEY2.1 35.23,11.48 C4.2 35.16,15.07 35.04,15.19 ; 35.04,15.19 v1(33.66,15.19) ; 35.04,15.19 R3.2 ; H2.13 66.29,40.89 61.34,45.84 37.6,45.84 37.14,45.38 U2.33 v1(37.14,33.9)
  Bottom Layer w0.254: v1(37.14,33.9) 33.66,30.41 v1(33.66,15.19)
KEY3: length 99.1
  Top Layer w0.254: U2.36 35.63,40.45 ; 35.63,40.45 v1(35.63,36.19) ; 35.63,40.45 35.63,46.54 36.45,47.36 63.12,47.36 65.79,44.7 70.87,44.7 H2.10 ; KEY3.1 47.42,10.9 C5.1 48.19,15.32 R4.2
  Bottom Layer w0.254: v1(35.63,36.19) 40.39,36.19 42.67,33.9 42.67,32.12 37.47,26.92 37.47,13.83 41.28,10.03 45.42,10.03 KEY3.1
LED1: length 65.5
  Top Layer w0.254: H2.17 64.77,35.81 63.88,36.69 63.88,39.36 59.69,43.55 v1(39.62,43.55) 39.12,43.05 39.12,40.57 ; R8.1 16.51,51.68 v1(24.64,43.55)
  Bottom Layer w0.254: v1(24.64,43.55) 39.37,43.55
LED2: length 80.1
  Top Layer w0.254: R9.1 27.92,53.02 27.94,53.05 ; 27.94,53.05 27.94,58.41 29.34,59.81 60.96,59.81 64.64,56.13 H2.1 ; 27.94,53.05 27.94,34.79 28.29,34.44 U2.46
NRST: length 70.4
  Top Layer w0.254: 7.37,34.56 7.37,36.08 7.11,36.33 CN1.2 ; 7.37,34.56 7.37,19.8 11.85,15.32 R7.2 12.76,11.68 C13.1 9.1,8.02 RST1.1 ; 7.37,34.56 7.39,34.54 v1(9.14,34.54) ; U2.7 v1(38.64,34.54)
  Bottom Layer w0.254: 38.61,34.54 v1(9.14,34.54)
OSC_IN: length 58.2
  Top Layer w0.254: 36.34,25.03 35.29,25.03 34.67,25.65 34.67,27.42 35.43,28.19 37.64,28.19 U2.5 ; 36.34,25.03 X1.1 ; 36.34,25.03 34.29,22.98 34.29,21.77 34.22,21.71 34.22,20.63 34.8,20.06 49.91,20.06 58.29,11.68 70.87,11.68 H2.36
OSC_OUT: length 44.7
  Top Layer w0.254: H2.35 57.91,12.95 49.15,21.71 C12.1 40.13,21.77 40.13,26.03 39.38,26.78 38.61,26.78 38.61,27.68 38.14,28.14 U2.6
PA1: length 43.7
  Top Layer w0.254: H2.33 57.28,15.49 55.25,17.52 55.25,29.71 54.86,30.09 41.21,30.09 40.64,30.66 40.64,31.93 U2.11
PA2: length 45.1
  Top Layer w0.254: 41.15,31.87 41.15,31.23 41.66,30.73 55.37,30.73 55.88,30.22 55.88,18.41 57.53,16.76 70.87,16.76 H2.32
PA3: length 40.9
  Top Layer w0.254: U2.13 55.33,33.44 56.64,32.12 56.64,19.3 57.91,18.03 H2.31
PA4: length 43
  Top Layer w0.254: U2.14 55.97,33.94 57.15,32.76 57.15,20.95 58.8,19.3 70.87,19.3 H2.30
PA5: length 39.2
  Top Layer w0.254: H2.29 59.31,20.57 57.66,22.22 57.66,33.39 56.61,34.44 U2.15
PA6: length 41.4
  Top Layer w0.254: H2.28 70.87,21.84 60.07,21.84 58.17,23.74 58.17,33.9 57.13,34.94 U2.16
PA7: length 37.6
  Top Layer w0.254: H2.27 60.58,23.11 58.67,25.01 58.67,34.54 57.77,35.44 U2.17
PA9: length 80.1
  Top Layer w0.254: 38.66,40.74 38.66,43.93 38.91,44.19 60.07,44.19 64.39,39.87 64.39,37.97 65.28,37.08 70.87,37.08 H2.16 ; v1(38.61,37.58) 38.64,37.62 U2.30
  Bottom Layer w0.254: v1(38.61,37.58) 4.55,37.58 CN1.3
PA10: length 76.6
  Top Layer w0.254: 8.46,41.33 9.84,41.33 v1(9.91,41.27) ; 8.46,41.33 R6.1 ; 8.46,41.33 CN1.4 ; v1(37.85,38.73) 38.14,39.02 U2.31 38.14,44.43 38.53,44.82 60.58,44.82 64.9,40.5 64.9,39.11 65.66,38.35 H2.15
  Bottom Layer w0.254: v1(9.91,41.27) 33.15,41.27 35.69,38.73 v1(37.85,38.73)
PA11: length 42
  Top Layer w0.254: U2.32 37.64,44.9 38.07,45.33 60.96,45.33 66.68,39.62 70.87,39.62 H2.14
PA13: length 43.3
  Top Layer w0.254: H2.12 70.87,42.16 66.04,42.16 61.85,46.35 37.21,46.35 36.64,45.78 U2.34
PA14: length 56.3
  Top Layer w0.254: H2.9 66.04,45.97 57.53,54.47 33.4,54.47 33.02,54.09 33.02,39.36 33.44,38.94 U2.37
PA15: length 65.1
  Top Layer w0.254: H2.8 70.87,47.24 65.53,47.24 57.66,55.11 v1(40.13,55.11) 32.77,55.11 32.51,54.86 32.51,38.69 32.77,38.44 U2.38
  Bottom Layer w0.254: v1(40.13,55.11) 40.13,51.43
PB0: length 39.9
  Top Layer w0.254: U2.18 42.65,35.93 58.17,35.93 59.18,34.92 59.18,26.28 61.09,24.38 70.87,24.38 H2.26
PB1: length 36.1
  Top Layer w0.254: H2.25 61.59,25.65 59.69,27.55 59.69,35.55 58.8,36.44 42.65,36.44 U2.19
PB2: length 38.3
  Top Layer w0.254: U2.20 42.65,36.95 59.18,36.95 60.2,35.93 60.2,28.95 62.23,26.92 70.87,26.92 H2.24
PB3: length 66.7
  Top Layer w0.254: 33.4,37.94 32.26,37.94 32,38.19 32,55.36 32.38,55.75 v1(38.86,55.75) 57.91,55.75 65.15,48.51 H2.7
  Bottom Layer w0.254: H1.5 38.86,50.16 38.86,55.62
PB4: length 70.2
  Top Layer w0.254: H2.6 70.87,49.78 64.77,49.78 58.04,56.51 v1(42.67,56.51) 32.13,56.51 31.5,55.87 31.5,37.69 31.75,37.44 U2.40
  Bottom Layer w0.254: v1(42.67,56.51) 42.67,51.43
PB5: length 72.4
  Top Layer w0.254: U2.41 31.24,36.94 30.99,37.19 30.99,56.38 31.75,57.14 v1(41.4,57.14) 58.29,57.14 64.39,51.05 H2.5
  Bottom Layer w0.254: 41.4,56.89 41.4,50.16 H1.7
PB6: length 75.1
  Top Layer w0.254: U2.42 30.73,36.44 30.48,36.69 30.48,56.89 31.37,57.78 v1(37.59,57.78) 58.55,57.78 64.01,52.32 70.87,52.32 H2.4
  Bottom Layer w0.254: v1(37.59,57.78) 37.59,51.43
PB7: length 77.9
  Top Layer w0.254: U2.43 30.48,35.94 29.84,36.57 29.84,57.52 30.86,58.54 v1(36.32,58.54) 59.69,58.54 64.26,53.97 69.22,53.97 H2.3
  Bottom Layer w0.254: H1.3 36.32,50.16 v1(36.32,58.54)
PB8: length 75
  Top Layer w0.254: H2.2 70.87,54.86 65.02,54.86 60.58,59.3 29.72,59.3 28.57,58.16 28.57,35.3 28.94,34.94 U2.45
PB10: length 34.2
  Top Layer w0.254: H2.23 62.99,28.19 60.71,30.47 60.71,36.31 59.58,37.44 U2.21
PB11: length 36.5
  Top Layer w0.254: U2.22 59.97,37.94 61.21,36.69 61.21,31.61 63.37,29.46 70.87,29.46 H2.22
PB12: length 36.7
  Top Layer w0.254: 41.15,40.48 41.15,41.14 41.53,41.52 57.53,41.52 61.85,37.2 61.85,32.12 63.25,30.73 H2.21
PB13: length 40.1
  Top Layer w0.254: H2.20 70.87,32 63.5,32 62.36,33.14 62.36,37.71 58.04,42.03 41.15,42.03 40.64,41.52 40.64,40.47
PB14: length 37.2
  Top Layer w0.254: 40.13,40.46 40.13,42.03 40.64,42.54 58.51,42.54 62.89,38.23 62.95,34.45 64.13,33.27 H2.19
PB15: length 40.6
  Top Layer w0.254: H2.18 70.87,34.54 64.64,34.54 63.42,35.75 63.42,38.93 59.31,43.05 40.26,43.05 39.62,42.41 39.62,40.45
PC13: length 56.2
  Top Layer w0.254: H2.39 59.94,7.87 49.66,18.15 34.04,18.15 31.93,20.26 31.93,26.85 36.14,31.07 U2.2
PC14: length 58
  Top Layer w0.254: U2.3 36.64,30.92 32.51,26.79 32.51,20.57 34.29,18.79 49.79,18.79 59.44,9.14 70.87,9.14 H2.38
PC15: length 53.6
  Top Layer w0.254: H2.37 69.47,10.28 59.04,10.28 49.9,19.42 34.54,19.42 33.15,20.82 33.15,26.66 37.14,30.66 U2.4
PF6: length 41
  Top Layer w0.254: U2.35 36.14,46.17 36.83,46.86 62.48,46.86 66.04,43.3 69.47,43.3 H2.11
$1N1351: length 3.7
  Top Layer w0.254: PWR_LED.2 11.05,54.53
$1N1886: length 8.2
  Top Layer w0.254: R2.2 25.28,10.14 KEY1.1
$1N6758: length 3.7
  Top Layer w0.254: LED1.1 16.51,54.53
$1N6761: length 3.7
  Top Layer w0.254: LED2.1 21.55,58.1 21.55,54.53

## Copper pours and planes (outline as drawn; the poured copper is in the pictures)
GND on Top Layer: -1.14,64.64 75.06,64.64 75.06,-0.9 -1.14,-0.9
GND on Bottom Layer: -1.4,64.76 75.06,64.76 75.06,-1.02 -1.4,-1.02

Small or netless copper shapes (teardrops, artwork), in the pictures only: 226 on Top Layer, 30 on Bottom Layer

## Text on the board
Top Silkscreen Layer: U0_RX | U0_TX | RTS | DTR | GND | 5V | PA14 | PA12 | PA10 | PB14 | PB12 | PB10 | PC15 | PC13 | PB7 | PB5 | PB3 | PA8 | PB1 | PA3 | PB9 | PF6 | PA7 | PA5 | PA1 | PF1 | PA15 | PC14 | PA13 | PA11 | PB15 | PB13 | PB11 | PB2 | PB0 | PF0 | PB4 | PF7 | PA4 | PA2 | PA0 | PB8 | PB6 | PA9 | PA6
